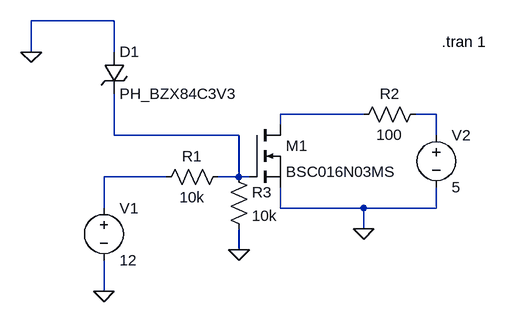
[diagram p0: schematic IGN signal in.asc]
IGN signal in.asc, the LTspice schematic file:
Version 4
SHEET 1 880 680
WIRE -48 -480 -176 -480
WIRE -176 -432 -176 -480
WIRE -48 -432 -48 -480
WIRE 336 -336 208 -336
WIRE 448 -336 416 -336
WIRE 208 -320 208 -336
WIRE -48 -304 -48 -368
WIRE 144 -304 -48 -304
WIRE 448 -304 448 -336
WIRE 32 -240 -64 -240
WIRE 144 -240 144 -304
WIRE 144 -240 112 -240
WIRE 160 -240 144 -240
WIRE -64 -192 -64 -240
WIRE 208 -192 208 -224
WIRE 336 -192 208 -192
WIRE 448 -192 448 -224
WIRE 448 -192 336 -192
WIRE 336 -160 336 -192
WIRE 144 -128 144 -160
WIRE -64 -64 -64 -112
FLAG 336 -160 0
FLAG -64 -64 0
FLAG 144 -128 0
FLAG -176 -432 0
SYMBOL voltage -64 -208 R0
SYMATTR InstName V1
SYMATTR Value 12
SYMBOL res 128 -256 R90
WINDOW 0 0 56 VBottom 2
WINDOW 3 32 56 VTop 2
SYMATTR InstName R1
SYMATTR Value 10k
SYMBOL voltage 448 -320 R0
WINDOW 123 0 0 Left 0
WINDOW 39 0 0 Left 0
SYMATTR InstName V2
SYMATTR Value 5
SYMBOL res 432 -352 R90
WINDOW 0 0 56 VBottom 2
WINDOW 3 32 56 VTop 2
SYMATTR InstName R2
SYMATTR Value 100
SYMBOL nmos 160 -320 R0
SYMATTR InstName M1
SYMATTR Value BSC016N03MS
SYMBOL res 128 -256 R0
SYMATTR InstName R3
SYMATTR Value 10k
SYMBOL zener -64 -432 R0
SYMATTR InstName D1
SYMATTR Value PH_BZX84C3V3
TEXT 456 -448 Left 2 !.tran 1

The netlist it stands for:
* IGN signal in.asc
V1 N004 0 12
R1 N003 N004 10k
V2 N002 0 5
R2 N002 N001 100
M1 N001 N003 0 0 BSC016N03MS
R3 N003 0 10k
D1 0 N003 PH_BZX84C3V3
.model D D
.lib standard.dio
.model NMOS NMOS
.model PMOS PMOS
.lib standard.mos
.tran 1
.backanno
.end